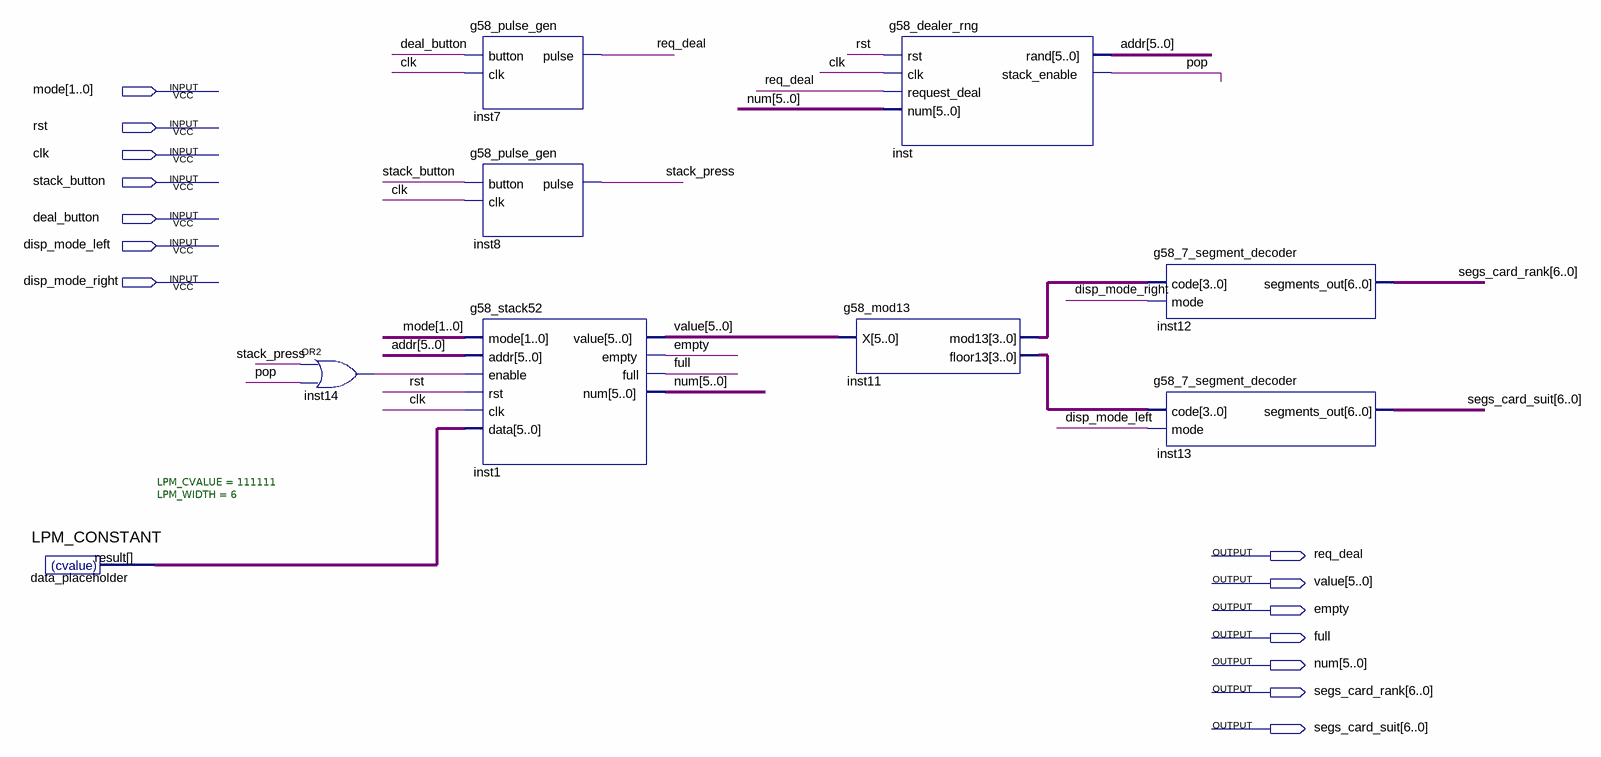
[diagram p0: schematic sheet]
// Quartus schematic g58_testbed.bdf as structural Verilog: 9 symbols, 14 pins
module g58_testbed (
  input  [1:0] mode,
  input  rst,
  input  clk,
  input  stack_button,
  input  deal_button,
  input  disp_mode_left,
  input  disp_mode_right,
  output req_deal,
  output [5:0] value,
  output empty,
  output full,
  output [5:0] num,
  output [6:0] segs_card_rank,
  output [6:0] segs_card_suit
);

  wire inst14_out, pop, stack_press;
  wire [3:0] inst11_floor13, inst11_mod13;
  wire [5:0] addr, data_placeholder_result;

  LPM_CONSTANT #(.LPM_CVALUE(111111), .LPM_WIDTH(6)) data_placeholder (.result(data_placeholder_result));
  or inst14 (inst14_out, stack_press, pop);
  g58_pulse_gen inst7 (.button(deal_button), .clk(clk), .pulse(req_deal));
  g58_pulse_gen inst8 (.button(stack_button), .clk(clk), .pulse(stack_press));
  g58_stack52 inst1 (
    .mode(mode), .addr(addr), .enable(inst14_out), .rst(rst), .clk(clk), .data(data_placeholder_result),
    .value(value), .empty(empty), .full(full), .num(num));
  g58_mod13 inst11 (.X(value), .mod13(inst11_mod13), .floor13(inst11_floor13));
  g58_dealer_rng inst (.rst(rst), .clk(clk), .request_deal(req_deal), .num(num), .\rand (addr), .stack_enable(pop));
  g58_7_segment_decoder inst12 (.code(inst11_mod13), .mode(disp_mode_right), .segments_out(segs_card_rank));
  g58_7_segment_decoder inst13 (.code(inst11_floor13), .mode(disp_mode_left), .segments_out(segs_card_suit));
endmodule
